# EAGLE design untitled (EAGLE 8.5.1)
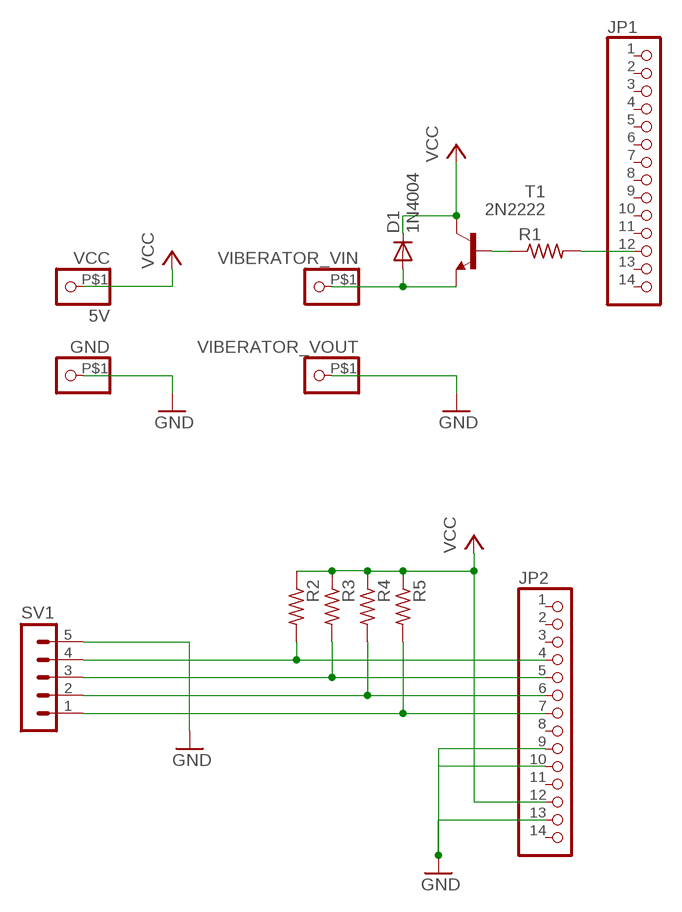
[diagram p0: schematic, sheet 1]

## Parts
D1  1N4004  [DO41-10]
GND  PINHD-1X1-BIGPOGO  [1X1-BIGPOGO]
JP1  PINHD-1X14-CB  [1X14-CB]
JP2  PINHD-1X14-CB  [1X14-CB]
R1  R-US_R0805  [R0805]
R2  R-US_R0805  [R0805]
R3  R-US_R0805  [R0805]
R4  R-US_R0805  [R0805]
R5  R-US_R0805  [R0805]
SV1  MA05-1  [MA05-1]
T1  2N2222  [TO92-EBC-OVAL]
VCC  5V  PINHD-1X1-BIGPOGO  [1X1-BIGPOGO]
VIBERATOR_VIN  PINHD-1X1-BIGPOGO  [1X1-BIGPOGO]
VIBERATOR_VOUT  PINHD-1X1-BIGPOGO  [1X1-BIGPOGO]

## Nets
GND: GND.P$1 JP2.9 JP2.10 JP2.13 SV1.5 VIBERATOR_VOUT.P$1
N$1: R1.1 T1.B
N$2: JP1.12 R1.2
N$3: JP2.7 R5.2 SV1.1
N$4: JP2.6 R4.2 SV1.2
N$5: JP2.5 R3.2 SV1.3
N$6: JP2.4 R2.2 SV1.4
N$7: D1.A T1.E VIBERATOR_VIN.P$1
VCC: D1.C JP2.12 R2.1 R3.1 R4.1 R5.1 T1.C VCC.P$1
Unconnected: JP1.1 JP1.2 JP1.3 JP1.4 JP1.5 JP1.6 JP1.7 JP1.8 JP1.9 JP1.10 JP1.11 JP1.13 JP1.14 JP2.1 JP2.2 JP2.3 JP2.8 JP2.11 JP2.14

## Library data of the parts
D1 = adafruit:1N4004: DIODE General purpose 1N400x type rectifier (With bigger pads) http://www.ladyada.net/library/pcb/eaglelibrary.html
GND VCC VIBERATOR_VIN VIBERATOR_VOUT = adafruit:PINHD-1X1: Pin header 1x1 for 0.1" spacing With round pins
JP1 JP2 = adafruit:PINHD-1X14: PIN HEADER
R1-R5 = rcl:R-US_: RESISTOR, American symbol; SPICEPREFIX: R
SV1 = con-lstb:MA05-1: PIN HEADER; OC_FARNELL: unknown; OC_NEWARK: unknown
T1 = adafruit:2N2222: NPN TRANSISTOR Big oval pads

## Board
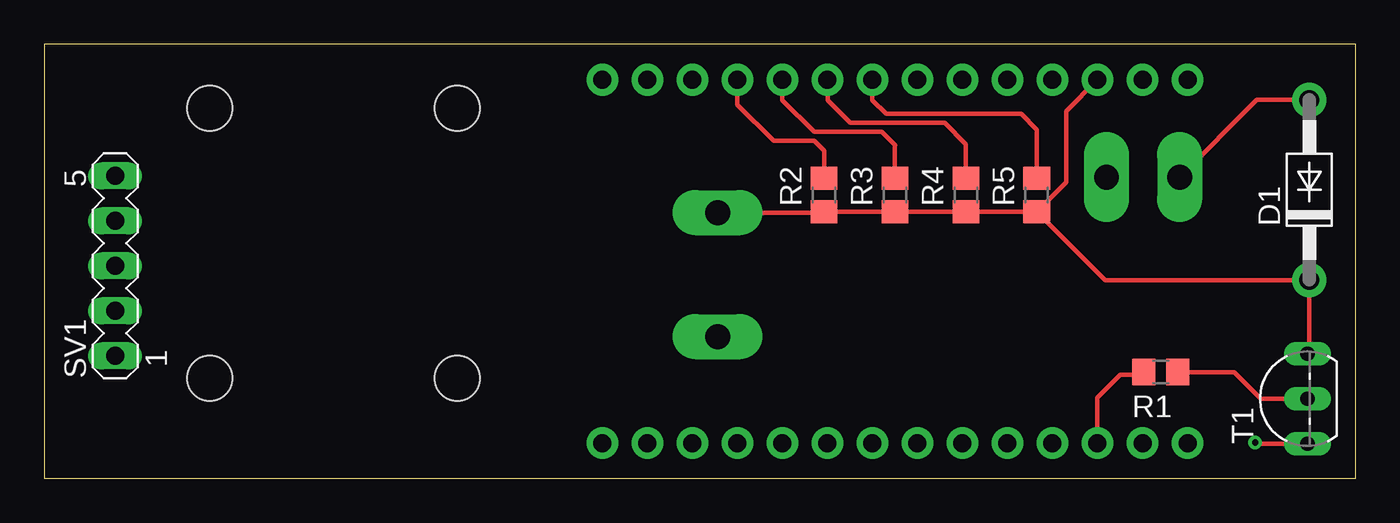
[diagram p1: board, top side]
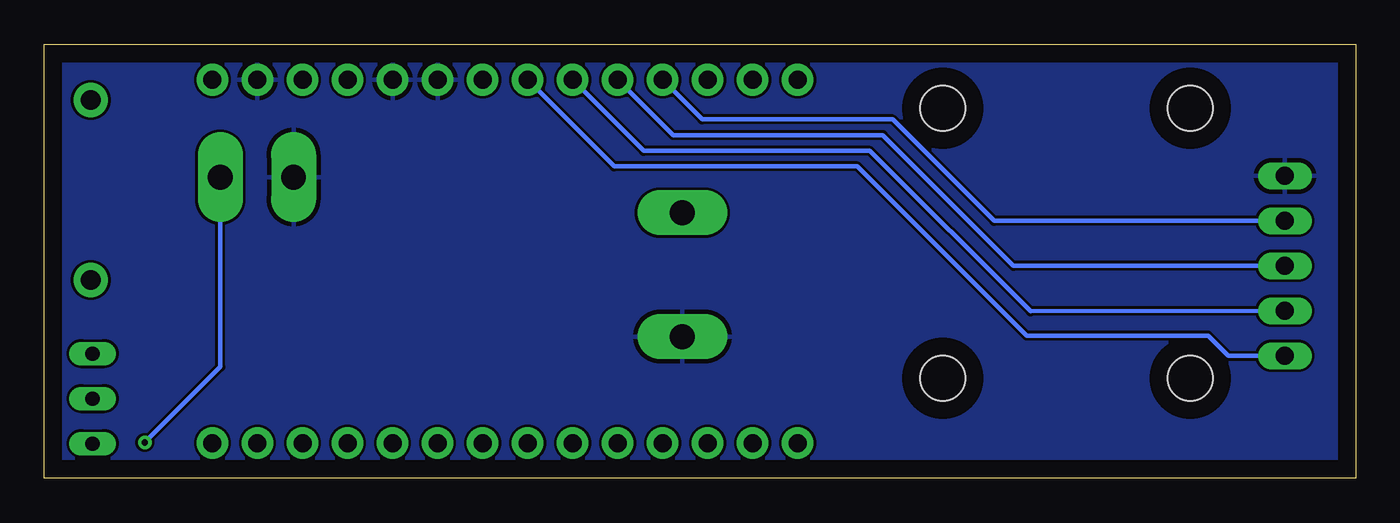
[diagram p2: board, bottom side, seen from below]

Size 74 x 24.5 mm. Coordinates in mm from the lower left corner, seen from the top.
Outline: 0,0 74,0 74,24.5 0,24.5 0,0
Copper layers (1*16): Top 0.035mm / dielectric 1.5mm / Bottom 0.035mm
Design rules "default": minimum track width 6mil, minimum drill 0.35mm, track to track 6mil, track to pad 6mil, pad to pad 6mil, via to via 6mil, smd to smd 6mil, copper to edge 40mil, drill to drill 6mil, minimum pad ring 10mil, minimum via ring 8mil, stop-mask expansion 4mil, vias tented up to drill 0mil, thermal gap 10mil
Holes 2.54 mm at 23.3,5.65 23.3,20.89 9.33,5.65 9.33,20.89

### Footprints (pad centres in the part's own frame; a part is rotated, then mirrored left to right if it is on the bottom)
DO41-10 = drill 1.118 pad 1.93: A 5.08,0; C -5.08,0
1X1-BIGPOGO = drill 1.4 pad 2.54 long: P$1 0,0
1X14-CB = drill 1.016 pad 1.778: 1 -16.51,0; 2 -13.97,0; 3 -11.43,0; 4 -8.89,0; 5 -6.35,0; 6 -3.81,0; 7 -1.27,0; 8 1.27,0; 9 3.81,0; 10 6.35,0; 11 8.89,0; 12 11.43,0; 13 13.97,0; 14 16.51,0
R0805 = smd 1.3 x 1.5: 1 -0.95,0; 2 0.95,0
MA05-1 = drill 1.016 long: 1 -5.08,0; 2 -2.54,0; 3 0,0; 4 2.54,0; 5 5.08,0
TO92-EBC-OVAL = drill 0.813 long: B 0,-1.27; C 2.54,-1.27; E -2.54,-1.27

### Placement (x,y rotation side)
D1  71.38,16.28 90 top
GND  38,8 0 top
JP1  48,2 0 top
JP2  48,22.5 0 top
R1  63,6 180 top
R2  44,16 90 top
R3  48,16 90 top
R4  52,16 90 top
R5  56,16 90 top
SV1  4,12 90 top
T1  70,4.5 90 top
VCC  38,15 0 top
VIBERATOR_VIN  64.06,17 270 bottom
VIBERATOR_VOUT  59.94,17 270 bottom

### Tracks (layer width: path | path; a pad name or v marks a point on that pad's centre or on a via)
GND
  pour Bottom: -0.51,24.38 -0.51,0 0.51,-1.02 73.66,-1.02 74.68,0 74.68,24.13 73.66,25.15 0.25,25.15
N$1
  Top 0.254: T1.B 68.65,4.5 67.15,6 R1.1
N$2
  Top 0.254: JP1.12 59.43,3.05 59.43,3.38 59.43,4.57 60.71,5.84 61.89,5.84 R1.2
N$3
  Top 0.254: JP2.7 46.73,21.34 47.5,20.57 55.12,20.57 56,19.69 R5.2
  Bottom 0.254: JP2.7 41.85,17.62 28.12,17.62 18.57,8.06 8.33,8.06 7.19,6.92 SV1.1
N$4
  Top 0.254: 52,17.32 R4.2 52,18.87 50.8,20.07 45.47,20.07 44.2,21.34 JP2.6
  Bottom 0.254: JP2.6 40.18,18.49 27.41,18.49 18.35,9.44 SV1.2
N$5
  Top 0.254: JP2.5 41.65,21.34 43.43,19.56 47.24,19.56 48.01,18.8 48,18.79 R3.2
  Bottom 0.254: SV1.3 19.32,12 26.68,19.37 38.52,19.37 JP2.5
N$6
  Top 0.254: JP2.4 39.12,21.08 41.15,19.05 43.43,19.05 44,18.48 R2.2
  Bottom 0.254: SV1.4 20.41,14.54 26.14,20.27 36.88,20.27 JP2.4
N$7  (via drill 0.35)
  Top 0.254: VIBERATOR_VIN.P$1 68.42,21.36 D1.A | T1.E 68.4,1.96 v68.33,2.03
  Bottom 0.254: v68.33,2.03 64.06,6.29 VIBERATOR_VIN.P$1
VCC
  Top 0.254: 37.99,14.99 VCC.P$1 43.95,15 R2.1 R3.1 R4.1 R5.1 | D1.C 71.38,11.18 | 71.38,11.18 71.38,7.15 T1.C | R5.1 59.87,11.18 71.38,11.18 | R5.1 57.66,16.71 57.66,20.73 JP2.12